# Altium schematic sheet UART Output.SchDoc: UART Output
size 203 x 127 mm; DrawnBy: Kace Chandler; DocumentNumber: 20; SheetNumber: 20; SheetTotal: 23
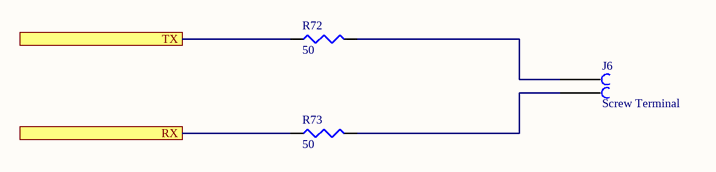
[diagram p0: UART Output.SchDoc]

## Parts
J6  Screw Terminal  [Screw Terminal]
R72  value 50  [0603 Footprint]  (hidden comment: Res3)
R73  value 50  [0603 Footprint]  (hidden comment: Res3)

## Ports
RX, TX

## Nets
RX: R73.1 ; port RX
TX: R72.1 ; port TX
NetJ6_1: J6.1 R72.2
NetJ6_2: J6.2 R73.2

## Library data of the parts
R72 R73 = Res3: Resistor; Published: 8-Jun-2000; LatestRevisionDate: 29-May-2009; LatestRevisionNote: IPC-7351 Footprint Added.; PackageReference: J1-0603; Publisher: Altium Limited; PackageDescription: Chip Resistor
J6 = Screw Terminal: Supplier 1: Digi-Key; Supplier Part Number 1: A112762-ND